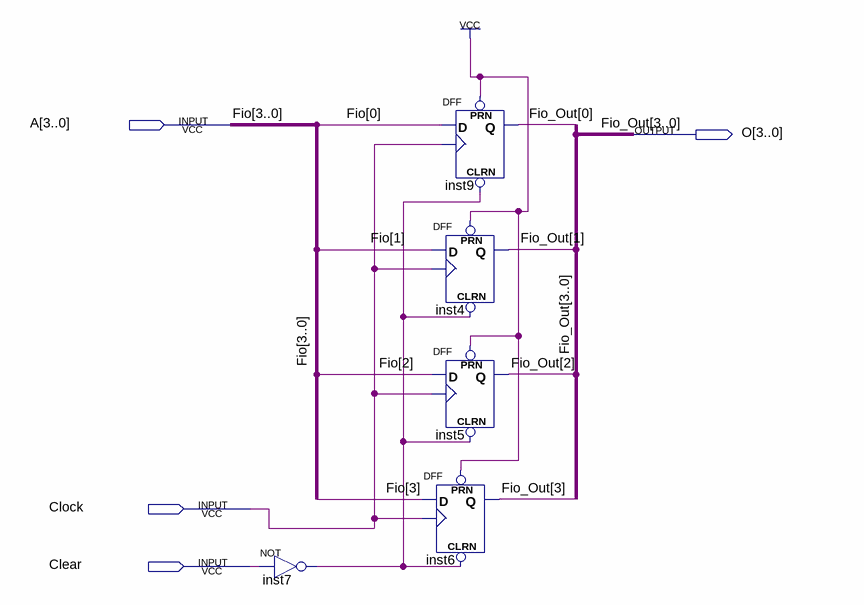
[diagram p0: schematic sheet]
// Quartus schematic Registrador_4_bits.bdf as structural Verilog: 5 symbols, 4 pins
module Registrador_4_bits (
  input  [3:0] A,
  input  Clock,
  input  Clear,
  output [3:0] O
);

  wire inst7_out;

  not inst7 (inst7_out, Clear);
  DFF inst9 (.CLRN(inst7_out), .CLK(Clock), .D(A[0]), .PRN(1'b1), .Q(O[0]));
  DFF inst4 (.CLRN(inst7_out), .CLK(Clock), .D(A[1]), .PRN(1'b1), .Q(O[1]));
  DFF inst5 (.CLRN(inst7_out), .CLK(Clock), .D(A[2]), .PRN(1'b1), .Q(O[2]));
  DFF inst6 (.CLRN(inst7_out), .CLK(Clock), .D(A[3]), .PRN(1'b1), .Q(O[3]));

  // Other names for the same wires on the sheet: Fio[3:0] = A; Fio_Out[3:0] = O
endmodule
